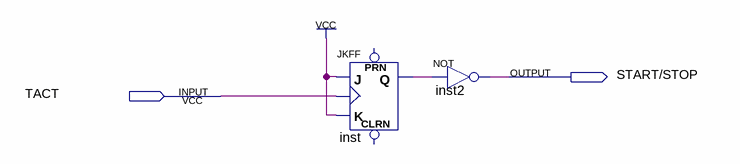
[diagram p0: schematic sheet]
// Quartus schematic START_STOP.bdf as structural Verilog: 2 symbols, 2 pins
module START_STOP (
  input  TACT,
  output \START/STOP 
);

  wire inst_q;

  JKFF inst (.K(1'b1), .J(1'b1), .CLK(TACT), .Q(inst_q));  // open: PRN, CLRN
  not inst2 (\START/STOP , inst_q);
endmodule
